# Altium schematic sheet PORTS_DRIVER.SchDoc
size A4; SheetNumber: 7; SheetTotal: 8
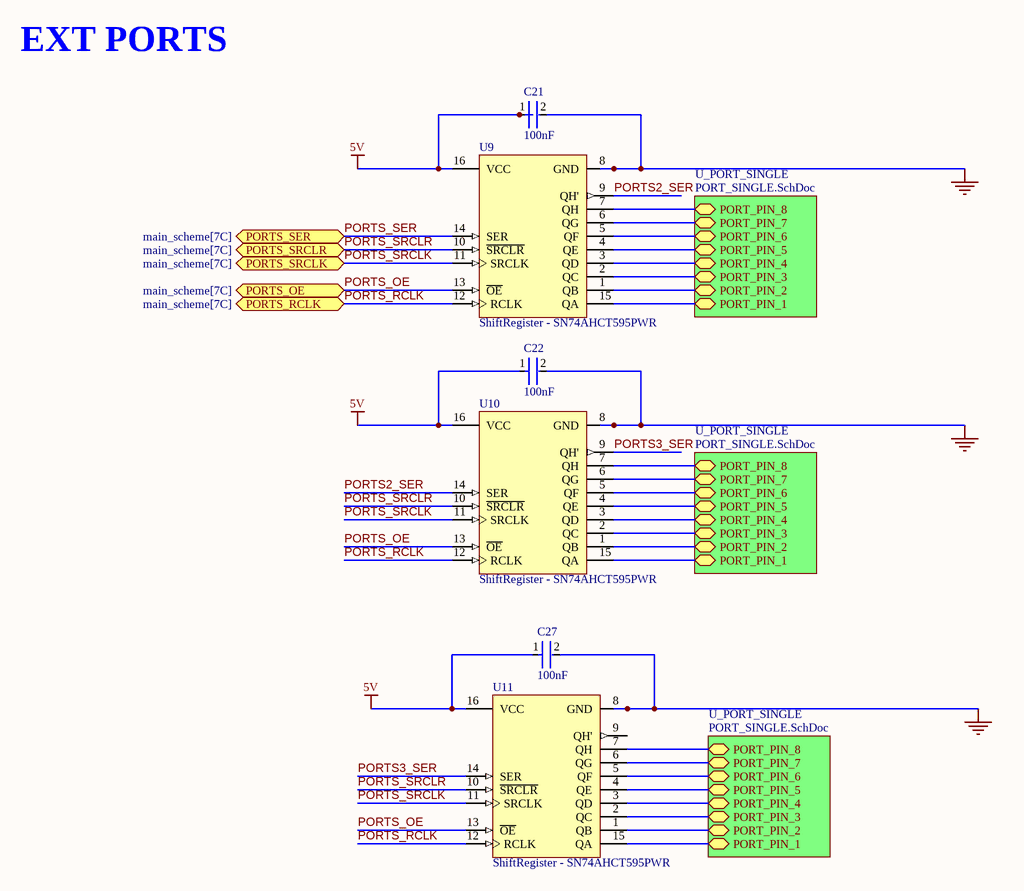
[diagram p0: PORTS_DRIVER.SchDoc]

## Parts
C21  100nF  [0402 CAP]
C22  100nF  [0402 CAP]
C27  100nF  [0402 CAP]
U9  ShiftRegister - SN74AHCT595PWR  [SSOT16]
U10  ShiftRegister - SN74AHCT595PWR  [SSOT16]
U11  ShiftRegister - SN74AHCT595PWR  [SSOT16]

## Sub-sheets
U_PORT_SINGLE = PORT_SINGLE.SchDoc: PORT_PIN_1 (bidir), PORT_PIN_2 (bidir), PORT_PIN_3 (bidir), PORT_PIN_4 (bidir), PORT_PIN_5 (bidir), PORT_PIN_6 (bidir), PORT_PIN_7 (bidir), PORT_PIN_8 (bidir)
U_PORT_SINGLE = PORT_SINGLE.SchDoc: PORT_PIN_1 (bidir), PORT_PIN_2 (bidir), PORT_PIN_3 (bidir), PORT_PIN_4 (bidir), PORT_PIN_5 (bidir), PORT_PIN_6 (bidir), PORT_PIN_7 (bidir), PORT_PIN_8 (bidir)
U_PORT_SINGLE = PORT_SINGLE.SchDoc: PORT_PIN_1 (bidir), PORT_PIN_2 (bidir), PORT_PIN_3 (bidir), PORT_PIN_4 (bidir), PORT_PIN_5 (bidir), PORT_PIN_6 (bidir), PORT_PIN_7 (bidir), PORT_PIN_8 (bidir)

## Ports
PORTS_OE (bidir, see main_scheme[7C]), PORTS_RCLK (bidir, see main_scheme[7C]), PORTS_SER (bidir, see main_scheme[7C]), PORTS_SRCLK (bidir, see main_scheme[7C]), PORTS_SRCLR (bidir, see main_scheme[7C])

## Nets
5V: C21.1 C22.1 C27.1 U9.16(VCC) U10.16(VCC) U11.16(VCC)
GND: C21.2 C22.2 C27.2 U9.8(GND) U10.8(GND) U11.8(GND)
PORTS2_SER: U9.9(QH') U10.14(SER)
PORTS3_SER: U10.9(QH') U11.14(SER)
PORTS_OE: U9.13(~{OE}) U10.13(~{OE}) U11.13(~{OE}) ; port PORTS_OE
PORTS_RCLK: U9.12(RCLK) U10.12(RCLK) U11.12(RCLK) ; port PORTS_RCLK
PORTS_SER: U9.14(SER) ; port PORTS_SER
PORTS_SRCLK: U9.11(SRCLK) U10.11(SRCLK) U11.11(SRCLK) ; port PORTS_SRCLK
PORTS_SRCLR: U9.10(~{SRCLR}) U10.10(~{SRCLR}) U11.10(~{SRCLR}) ; port PORTS_SRCLR
NetU9_1: U9.1(QB) ; sheet U_PORT_SINGLE/PORT_PIN_2
NetU9_2: U9.2(QC) ; sheet U_PORT_SINGLE/PORT_PIN_3
NetU9_3: U9.3(QD) ; sheet U_PORT_SINGLE/PORT_PIN_4
NetU9_4: U9.4(QE) ; sheet U_PORT_SINGLE/PORT_PIN_5
NetU9_5: U9.5(QF) ; sheet U_PORT_SINGLE/PORT_PIN_6
NetU9_6: U9.6(QG) ; sheet U_PORT_SINGLE/PORT_PIN_7
NetU9_7: U9.7(QH) ; sheet U_PORT_SINGLE/PORT_PIN_8
NetU9_15: U9.15(QA) ; sheet U_PORT_SINGLE/PORT_PIN_1
NetU10_1: U10.1(QB) ; sheet U_PORT_SINGLE/PORT_PIN_2
NetU10_2: U10.2(QC) ; sheet U_PORT_SINGLE/PORT_PIN_3
NetU10_3: U10.3(QD) ; sheet U_PORT_SINGLE/PORT_PIN_4
NetU10_4: U10.4(QE) ; sheet U_PORT_SINGLE/PORT_PIN_5
NetU10_5: U10.5(QF) ; sheet U_PORT_SINGLE/PORT_PIN_6
NetU10_6: U10.6(QG) ; sheet U_PORT_SINGLE/PORT_PIN_7
NetU10_7: U10.7(QH) ; sheet U_PORT_SINGLE/PORT_PIN_8
NetU10_15: U10.15(QA) ; sheet U_PORT_SINGLE/PORT_PIN_1
NetU11_1: U11.1(QB) ; sheet U_PORT_SINGLE/PORT_PIN_2
NetU11_2: U11.2(QC) ; sheet U_PORT_SINGLE/PORT_PIN_3
NetU11_3: U11.3(QD) ; sheet U_PORT_SINGLE/PORT_PIN_4
NetU11_4: U11.4(QE) ; sheet U_PORT_SINGLE/PORT_PIN_5
NetU11_5: U11.5(QF) ; sheet U_PORT_SINGLE/PORT_PIN_6
NetU11_6: U11.6(QG) ; sheet U_PORT_SINGLE/PORT_PIN_7
NetU11_7: U11.7(QH) ; sheet U_PORT_SINGLE/PORT_PIN_8
NetU11_15: U11.15(QA) ; sheet U_PORT_SINGLE/PORT_PIN_1

Not connected (* = marked no-connect by the designer): U11 9(QH')

## Notes on the sheet
- EXT PORTS

## Library data of the parts
C21 C22 C27 = CAP 0402 - 100nF: Cap Ceramic 0402,0.1uF, 25V,10%; PartNumber: C0402C104K3RACTU; Value: 100nF; Package: 0402; Supplier 1: Mouser; Supplier Part Number 1: 80-C0402C104K3R; ComponentLink1Description: myLinks; ComponentLink1URL: https://eu.mouser.com/ProductDetail/KEMET/C0402C104K3RACTU?qs=YCcZ0GhAU2q7BaxZ%2FluQHA%3D%3D
U9-U11 = ShiftRegister - SN74AHCT595PWR: 8-Bit Shift Registers With 3-State Output Registers, PW0016A, LARGE T&R; Value: 8bit - 5VPwr - 3V3 compatible logic; Package: TSSOP-16; PartNumber: SN74AHCT595PWR; ComponentLink1Description: myLinks; ComponentLink1URL: https://cz.mouser.com/ProductDetail/?qs=spW5eSrOWB5KP%2FLOxGLzFA%3D%3D; Supplier 1: Mouser; Supplier Part Number 1: 595-SN74AHCT595PWR